# Altium schematic sheet ADC.SchDoc: ADC
size 420 x 297 mm; Author: P. Zdunek; DrawnBy: P. Zdunek; DocumentNumber: 8; SheetNumber: 8; SheetTotal: 37; PageSetup: Record=PageOptions|CenterHorizontal=True|CenterVertical=True|PrintScale=0.82|XCorrection=1.00|YCorrection=1.00|PrintKind=2|BorderSize=5000000|LeftOffset=0|BottomOffset=0|Orientation=2|PaperLength=1000|PaperWidth=1000|Scale=100|PaperSource=15|PrintQuality=600|MediaType=1|DitherType=10|PaperKind=Letter|PrintScaleMode=1; ModifiedBy: -; CheckedDate: -; Title2: Fast Stabilizer; DivGrp: WUT ISE; Designer: G.Kasprowicz
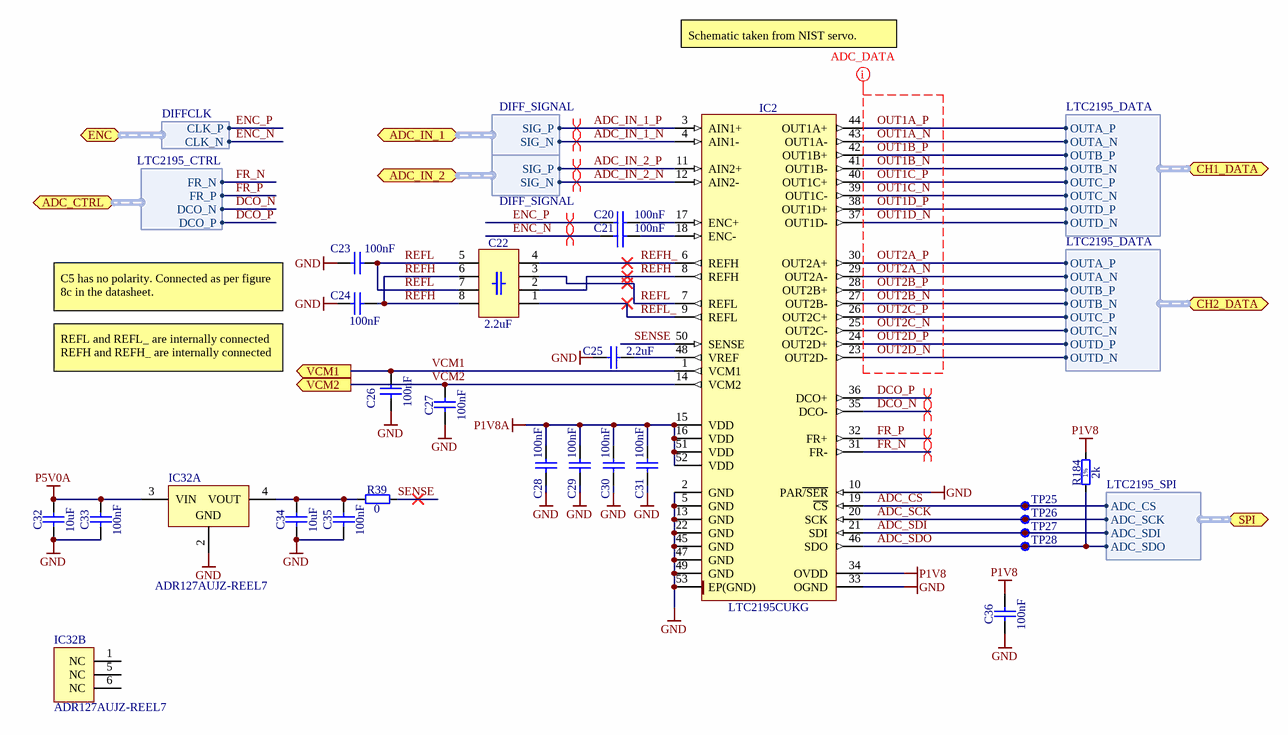
[diagram p0: ADC.SchDoc]

## Parts
C20  100nF  [CAPC1005X55N]
C21  100nF  [CAPC1005X55N]
C22  2.2uF  [CAPCAF50P125X200X95-8N]
C23  100nF  [CAPC1005X55N]
C24  100nF  [CAPC1005X55N]
C25  2.2uF  [CAPC2012X140N]
C26  100nF  [CAPC1005X55N]
C27  100nF  [CAPC1005X55N]
C28  100nF  [CAPC1005X55N]
C29  100nF  [CAPC1005X55N]
C30  100nF  [CAPC1005X55N]
C31  100nF  [CAPC1005X55N]
C32  10uF  [CAPC1608X80N]
C33  100nF  [CAPC1005X55N]
C34  10uF  [CAPC1608X80N]
C35  100nF  [CAPC1005X55N]
C36  100nF  [CAPC1005X55N]
IC2  LTC2195CUKG  [QFN50P700X800X80-53N-R655X550]
IC32  ADR127AUJZ-REEL7  [ADI-UJ-6_M]  (parts A,B of 2)
R39  0  [RESC1005X40N]
R184  2k  [RESC1005X40N]
TP25  SMD Pad  [C100]  (value not drawn)  (no BOM)
TP26  SMD Pad  [C100]  (value not drawn)  (no BOM)
TP27  SMD Pad  [C100]  (value not drawn)  (no BOM)
TP28  SMD Pad  [C100]  (value not drawn)  (no BOM)

## Ports
ADC_CTRL (bidir, harness LTC2195_CTRL), ADC_IN_1 (bidir, harness DIFF_SIGNAL), ADC_IN_2 (bidir, harness DIFF_SIGNAL), CH1_DATA (bidir, harness LTC2195_DATA), CH2_DATA (bidir, harness LTC2195_DATA), ENC (bidir, harness DIFFCLK), SPI (bidir, harness LTC2195_SPI), VCM1 (out), VCM2 (out)

## Harnesses
LTC2195_DATA: OUTD_N, OUTD_P, OUTC_N, OUTC_P, OUTB_N, OUTB_P, OUTA_N, OUTA_P
LTC2195_SPI: ADC_CS, ADC_SCK, ADC_SDI, ADC_SDO
DIFF_SIGNAL: SIG_N, SIG_P
LTC2195_CTRL: FR_N, FR_P, DCO_N, DCO_P
DIFFCLK: CLK_P, CLK_N

## Nets
GND: C23.2 C24.2 C25.1 C26.1 C27.1 C28.2 C29.2 C30.2 C31.2 C32.1 C33.1 C34.1 C35.1 C36.1 IC2.2(GND) IC2.5(GND) IC2.10(PAR~{/SER}) IC2.13(GND) IC2.22(GND) IC2.33(OGND) IC2.45(GND) IC2.47(GND) IC2.49(GND) IC2.53(EP(GND)) IC32.2(GND)
P1V8: C36.2 IC2.34(OVDD) R184.2
P1V8A: C28.1 C29.1 C30.1 C31.1 IC2.15(VDD) IC2.16(VDD) IC2.51(VDD) IC2.52(VDD)
P5V0A: C32.2 C33.2 IC32.3(VIN)
ADC_CS: IC2.19(~{CS}) TP25.1 ; port SPI.ADC_CS
ADC_IN_1_N: IC2.4(AIN1-) ; port ADC_IN_1.SIG_N
ADC_IN_1_P: IC2.3(AIN1+) ; port ADC_IN_1.SIG_P
ADC_IN_2_N: IC2.12(AIN2-) ; port ADC_IN_2.SIG_N
ADC_IN_2_P: IC2.11(AIN2+) ; port ADC_IN_2.SIG_P
ADC_SCK: IC2.20(SCK) TP26.1 ; port SPI.ADC_SCK
ADC_SDI: IC2.21(SDI) TP27.1 ; port SPI.ADC_SDI
ADC_SDO: IC2.46(SDO) R184.1 TP28.1 ; port SPI.ADC_SDO
DCO_N: IC2.35(DCO-) ; port ADC_CTRL.DCO_N
DCO_P: IC2.36(DCO+) ; port ADC_CTRL.DCO_P
ENC_N: C21.2 ; port ENC.CLK_N
ENC_P: C20.2 ; port ENC.CLK_P
FR_N: IC2.31(FR-) ; port ADC_CTRL.FR_N
FR_P: IC2.32(FR+) ; port ADC_CTRL.FR_P
OUT1A_N: IC2.43(OUT1A-) ; port CH1_DATA.OUTA_N
OUT1A_P: IC2.44(OUT1A+) ; port CH1_DATA.OUTA_P
OUT1B_N: IC2.41(OUT1B-) ; port CH1_DATA.OUTB_N
OUT1B_P: IC2.42(OUT1B+) ; port CH1_DATA.OUTB_P
OUT1C_N: IC2.39(OUT1C-) ; port CH1_DATA.OUTC_N
OUT1C_P: IC2.40(OUT1C+) ; port CH1_DATA.OUTC_P
OUT1D_N: IC2.37(OUT1D-) ; port CH1_DATA.OUTD_N
OUT1D_P: IC2.38(OUT1D+) ; port CH1_DATA.OUTD_P
OUT2A_N: IC2.29(OUT2A-) ; port CH2_DATA.OUTA_N
OUT2A_P: IC2.30(OUT2A+) ; port CH2_DATA.OUTA_P
OUT2B_N: IC2.27(OUT2B-) ; port CH2_DATA.OUTB_N
OUT2B_P: IC2.28(OUT2B+) ; port CH2_DATA.OUTB_P
OUT2C_N: IC2.25(OUT2C-) ; port CH2_DATA.OUTC_N
OUT2C_P: IC2.26(OUT2C+) ; port CH2_DATA.OUTC_P
OUT2D_N: IC2.23(OUT2D-) ; port CH2_DATA.OUTD_N
OUT2D_P: IC2.24(OUT2D+) ; port CH2_DATA.OUTD_P
REFH: C22.2 C22.6 C22.8 C24.1 IC2.8(REFH)
REFH_: C22.4 IC2.6(REFH)
REFL: C22.3 C22.5 C22.7 C23.1 IC2.7(REFL)
REFL_: C22.1 IC2.9(REFL)
SENSE: IC2.50(SENSE) R39.2
VCM1: C26.2 IC2.1(VCM1) ; port VCM1
VCM2: C27.2 IC2.14(VCM2) ; port VCM2
NetC20_1: C20.1 IC2.17(ENC+)
NetC21_1: C21.1 IC2.18(ENC-)
NetC25_2: C25.2 IC2.48(VREF)
NetC34_2: C34.2 C35.2 IC32.4(VOUT) R39.1

Not connected (* = marked no-connect by the designer): IC32 1(NC) 5(NC) 6(NC)

## Layout directives
differential pair: ADC_IN_1_N, ADC_IN_1_P, ADC_IN_2_N, ADC_IN_2_P, DCO_N, DCO_P, ENC_N, ENC_P, FR_N, FR_P
mark named ADC_DATA: OUT1A_N, OUT1A_P, OUT1B_N, OUT1B_P, OUT1C_N, OUT1C_P, OUT1D_N, OUT1D_P, OUT2A_N, OUT2A_P, OUT2B_N, OUT2B_P, OUT2C_N, OUT2C_P, OUT2D_N, OUT2D_P

## Notes on the sheet
- Schematic taken from NIST servo.
- C5 has no polarity. Connected as per figure 8c in the datasheet.
- REFL and REFL_ are internally connected
  REFH and REFH_ are internally connected
- Project/Equipment
- Document
- Designer
- Drawn by
- Check.by
- Copyright WUT ISE 2020.
  This documentation describes Open Hardware and is licensed under the CERN OHL v.1.2. You may redistribute and modify this documentation under the terms of the CERN OHL v.1.2. (http://ohwr.org/CERNOHL). This documentation is distributed WITHOUT ANY EXPRESS OR IMPLIED WARRANTY, INCLUDING OF MERCHANTABILITY, SATISFACTORY QUALITY AND FITNESS FOR A PARTICULAR PURPOSE. Please see the CERN OHL v.1.2 for applicable conditions.
- Contact
- File
- Last Mod.
- Print Date
- Sheet
- Size
- A3
- of
- Rev
- (in symbol R0402_2K_1%_0.0625W_100PPM) 1%

## Library data of the parts
C20 C21 C23 C24 C26-C31 C33 C35 C36 = CC0402_100NF_16V_10%_X5R: Non-polarised capacitor; Part Description: SMD Multilayer Chip Ceramic Capacitor; Manufacturer: GENERIC; Manufacturer1 Part Number: GRM155R61C104KA88D; Voltage: 16V; TC: X5R; Tolerance: ±10%; Part Number: CC0402_100NF_16V_10%_X5R; Component Kind: Standard; Component Type: Standard; Pin Count: 2; Value: 100nF; Status: None; Manufacturer Part Number: CC0402_100NF_16V_10%_X5R; Case: 0402; Mounted: Yes; Socket: No; SMD: Yes; Sense: No; Manufacturer1 Example: MURATA; Manufacturer1 ComponentHeight: 0.55mm; HelpURL: \\cern.ch\dfs\Applications\Altium\Datasheets\CC0402_X5R_MURATA_GRM.pdf; Author: CERN DEM JLC; CreateDate: 10.12.2013; LatestRevisionDate: 10.12.2013
C22 = CC0508_2.2UF_4V_20%_X7S_MURATA_LLA219C70G225M: 8 Terminals Low ESL Chip Multilayer Ceramic Capacitors for General Purpose; Manufacturer: MURATA; Manufacturer Part Number: LLA219C70G225MA01L; Voltage: 4V; TC: X7S; Tolerance: ±20%; Part Number: CC0508_2.2UF_4V_20%_X7S_MURATA_LLA219C70G225M; Component Kind: Standard; Component Type: Standard; Pin Count: 8; Value: 2.2uF; Status: None; Part Description: 8 Terminals Low ESL Chip Multilayer Ceramic Capacitors for General Purpose; Case: 0508; Mounted: Yes; Socket: No; SMD: Yes; Sense: No; ComponentHeight: 0.95mm; HelpURL: \\cern.ch\dfs\Applications\Altium\Datasheets\CC0508_X7S_MURATA_LLA219C70G225M.pdf; Author: CERN DEM BC; CreateDate: 07/07/2020; LatestRevisionDate: 07/07/2020
C25 = CC0805_2.2UF_50V_10%_X7R: Non-polarised capacitor; Part Description: SMD Multilayer Chip Ceramic Capacitor; Manufacturer: GENERIC; Manufacturer1 Part Number: GRM21BR61H225KA73L; Voltage: 50V; TC: X7R; Tolerance: ±10%; Part Number: CC0805_2.2UF_50V_10%_X7R; Component Kind: Standard; Component Type: Standard; Pin Count: 2; Value: 2.2uF; Status: Preferred; Manufacturer Part Number: CC0805_2.2UF_50V_10%_X7R; Case: 0805; Mounted: Yes; Socket: No; SMD: Yes; Sense: No; Manufacturer1 Example: MURATA; Manufacturer1 ComponentHeight: 1.40mm; HelpURL: \\cern.ch\dfs\Applications\Altium\Datasheets\CC0805_X7R_MURATA_GRM.pdf; Author: CERN DEM JLC; CreateDate: 18/08/2014; LatestRevisionDate: 18/08/2014
C32 C34 = CC0603_10UF_10V_10%_X5R: Non-polarised capacitor; Part Description: SMD Multilayer Chip Ceramic Capacitor; Manufacturer: GENERIC; Manufacturer1 Part Number: GRM188R61A106KE69D; Voltage: 10V; TC: X5R; Tolerance: ±10%; Part Number: CC0603_10UF_10V_10%_X5R; Component Kind: Standard; Component Type: Standard; Pin Count: 2; Value: 10uF; Status: None; Manufacturer Part Number: CC0603_10UF_10V_10%_X5R; Case: 0603; Mounted: Yes; Socket: No; SMD: Yes; Sense: No; Manufacturer1 Example: MURATA; Manufacturer1 ComponentHeight: 0.8mm; HelpURL: \\cern.ch\dfs\Applications\Altium\Datasheets\CC0603_MURATA_GRM188R61A106KE69D.pdf; Author: CERN DEM JLC; CreateDate: 31/01/2017; LatestRevisionDate: 31/01/2017
IC2 = LTC2195CUKG: 16-Bit, 125Msps Low Power Dual ADCs; Manufacturer: ANALOG DEVICES; PressFit: No; Bonding: No; Part Number: LTC2195CUKG; Component Kind: Standard; Component Type: Standard; Device: LTC2195CUKG; PackageDescription: QFN, 0.50mm Pitch, Rect.; 12 pin X 14 Pin, 7.00mm L X 8.00mm W X 0.80mm H body (w/Thermal Tab 6.55 X 5.50mm), IPC Medium Density; Part Description: 16-Bit, 125Msps Low Power Dual ADCs; Manufacturer Part Number: LTC2195CUKG; Pin Count: 53; Case: QFN52; Mounted: Yes; Socket: No; SMD: Yes; Sense: No; ComponentHeight: 0.8mm; Author: CERN DEM BC; HelpURL: \\cern.ch\dfs\Applications\Altium\Datasheets\LTC2195CUKG.pdf; CreateDate: 06/07/2020; LatestRevisionDate: 06/07/2020
IC32 = CMP-0784-00538-1: Precision, Micropower LDO Voltage Reference in TSOT, 1.25 V Output, 2.7 to 18 V Supply, Industrial, 6-pin SOT23 (UJ-6), Reel; Manufacturer: Analog Devices; Max V Supply (V): 18; Vout: 1.25V; Min V Supply (V): 2.7; Ref Out TC (ppm/C): 15; ComponentLink4Description: URL Link1; DatasheetVersion: Rev. B; PackageDescription: 6-Pin Thin Small Outline Transistor Package, Body 2.9 x 1.6 mm, Pitch 0.95 mm; PackageReference: UJ-6; PackageVersion: Dec-04; ComponentLink2Description: Datasheet; ComponentLink1URL: http://www.analog.com/en/index.html; ComponentLink3URL: http://www.analog.com/static/imported-files/packages/PKG_PDF/TSOT(UJ)/UJ_6.pdf; Operating Temp Range: -40 to 125 degC; ComponentLink3Description: Package Specification; Mounting Technology: Surface Mount; ComponentLink1Description: Manufacturer URL; Packing: Reel; PartNumber: ADR127AUJZ-REEL7; ComponentLink2URL: http://www.analog.com/static/imported-files/data_sheets/ADR121_125_127.pdf; ComponentLink4URL: Product URL:http://www.analog.com/en/special-linear-functions/voltage-references/adr127/products/product.html; Code_JEDEC: MO-193-AA
R39 = R0402_0R_JUMPER: Resistor; Part Description: 1A (0.05R Max DC Resistance) Zero Ohm Jumper; Manufacturer: GENERIC; Manufacturer1 Part Number: 232270591001L; PressFit: No; Part Number: R0402_0R_JUMPER; Component Kind: Standard; Component Type: Standard; Pin Count: 2; Value: 0; Status: Not Recommended; Manufacturer Part Number: R0402_0R_JUMPER; Case: 0402; Mounted: Yes; Sense: No; Socket: No; SMD: Yes; Manufacturer1 Example: YAGEO PHYCOMP; Manufacturer1 ComponentHeight: 0.4mm; HelpURL: \\cern.ch\dfs\Applications\Altium\Datasheets\R0402_Phycomp_RC0402.pdf; Author: CERN DEM JLC; CreateDate: 03/12/2007; LatestRevisionDate: 17/10/2012
R184 = R0402_2K_1%_0.0625W_100PPM: Resistor - 1%; Part Description: General Purpose Thick Film Chip Resistor; Manufacturer: GENERIC; Manufacturer1 Part Number: 232270672002L; PressFit: No; TC: ±100ppm/°C; Part Number: R0402_2K_1%_0.0625W_100PPM; Component Kind: Standard; Component Type: Standard; Pin Count: 2; Value: 2k; Status: Not Recommended; Manufacturer Part Number: R0402_2K_1%_0.0625W_100PPM; Case: 0402; Mounted: Yes; Sense: No; Socket: No; SMD: Yes; Manufacturer1 Example: YAGEO PHYCOMP; Manufacturer1 ComponentHeight: 0.4mm; HelpURL: \\cern.ch\dfs\Applications\Altium\Datasheets\R0402_Phycomp_RC0402.pdf; Author: CERN DEM JLC; CreateDate: 03/12/2007; LatestRevisionDate: 17/10/2012; Power: 0.0625W; Tolerance: ±1%
TP25-TP28 = SMD_PAD_D1MM: Through Hole Pad; Part Description: 1mm Diameter SMD Pad; Mounted: No; Part Number: SMD_PAD_D1MM; Component Type: Standard (No BOM); Pin Count: 1; Family: SMD Pad; Socket: No; SMD: Yes; Sense: No; Status: None; ComponentHeight: 0mm; HelpURL: Undefined; Author: CERN DEM JLC; CreateDate: 10/10/2017; LatestRevisionDate: 10/10/2017; PackageDescription: 1mm Diameter SMD Pad